# Altium schematic sheet device.SchDoc
size A4
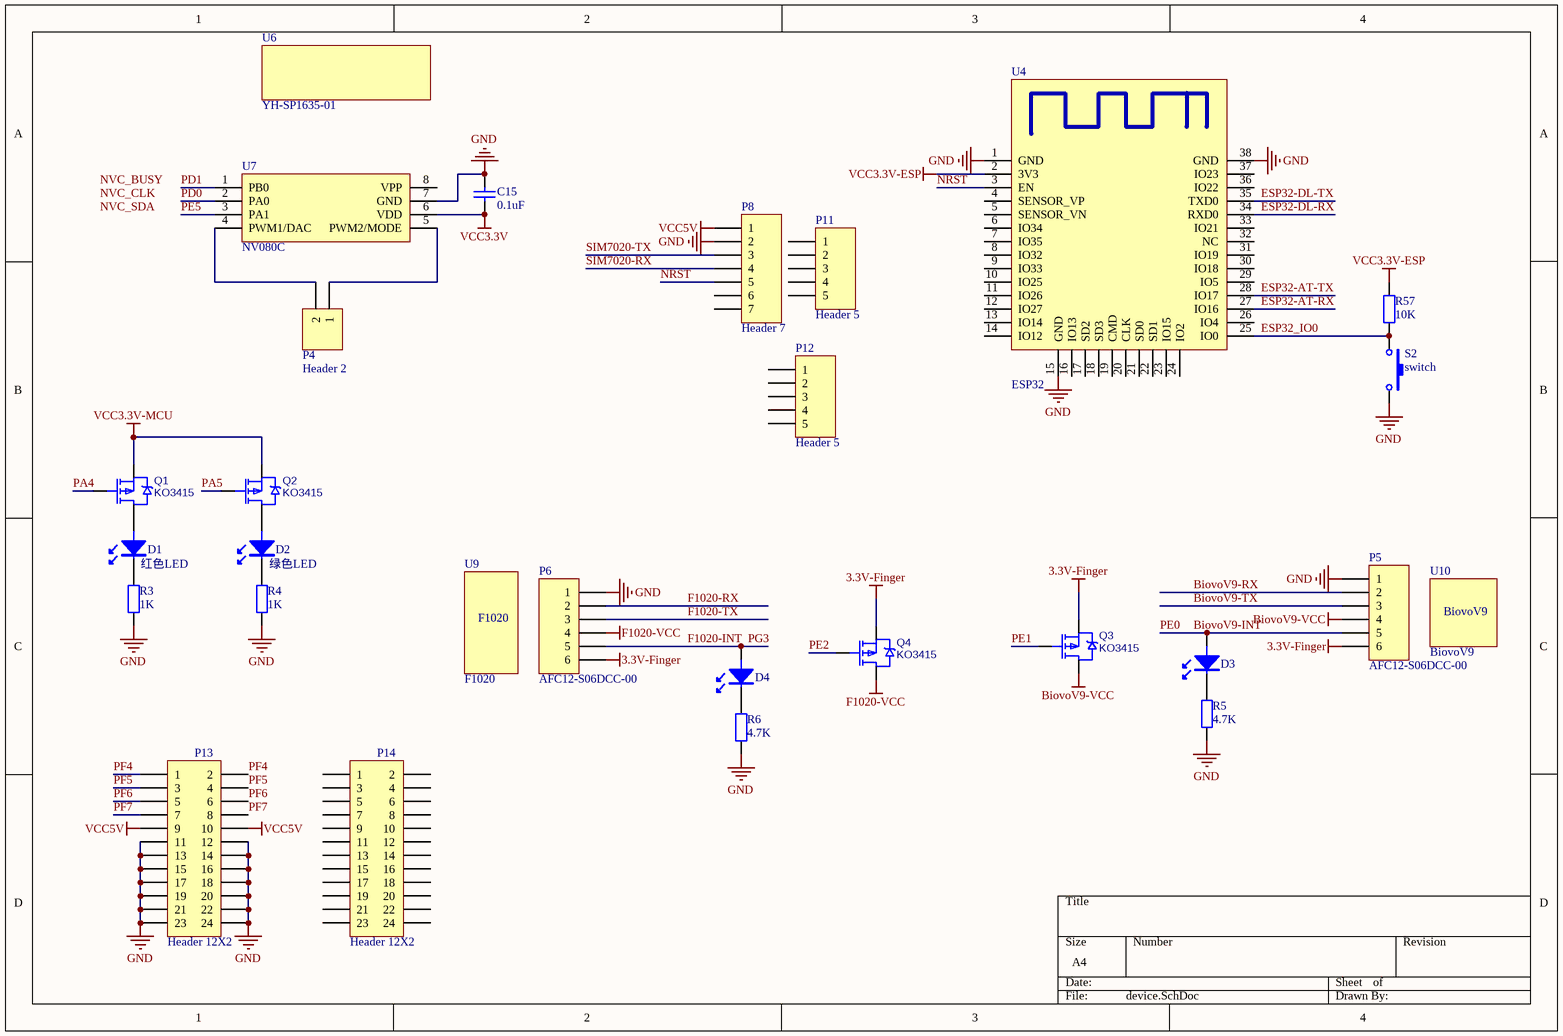
[diagram p0: device.SchDoc]

## Parts
C15  0.1uF  [0603_C]
D1  红色LED  [LED_1206]
D2  绿色LED  [LED_1206]
D3  LED  [0603_LED_S1]  (value not drawn)
D4  LED  [0603_LED_S1]  (value not drawn)
P4  Header 2  [HDR1X2]
P5  AFC12-S06DCC-00  [CONN-SMD_6PIN_AFC12-S06DCC-00_PITCH1.25-L]
P6  AFC12-S06DCC-00  [CONN-SMD_6PIN_AFC12-S06DCC-00_PITCH1.25-L]
P8  Header 7  [HDR1X7]
P11  Header 5  [HDR1X5]
P12  Header 5  [HDR1X5]
P13  Header 12X2  [2.0mm 2*12P直排母]
P14  Header 12X2  [2.0mm 2*12P直排母]
Q1  KO3415  [SOT-23(SOT-23-3)]
Q2  KO3415  [SOT-23(SOT-23-3)]
Q3  KO3415  [SOT-23(SOT-23-3)]
Q4  KO3415  [SOT-23(SOT-23-3)]
R3  1K  [0603_R]
R4  1K  [0603_R]
R5  4.7K  [0603_R]
R6  4.7K  [0603_R]
R57  10K  [0603_R]
S2  switch  [SW-SMD_4P-L6.2-W6.2-P4.50-LS9.0]
U4  ESP32  [WIFIM-SMD_ESP32-S32MB]
U6  YH-SP1635-01  [YH-SP1635-01]
U7  NV080C  [SOP-8_150mil]
U9  F1020  [F1020]
U10  BiovoV9  [BiovoV9]

## Nets
3.3V-Finger: P5.6 P6.6 Q3.2(S) Q4.2(S)
BiovoV9-VCC: P5.4 Q3.3(D)
F1020-VCC: P6.4 Q4.3(D)
GND: C15.2 P5.1 P6.1 P8.2 P13.11 P13.12 P13.13 P13.14 P13.15 P13.16 P13.17 P13.18 P13.19 P13.20 P13.21 P13.22 P13.23 P13.24 R3.1 R4.1 R5.1 R6.1 S2.2 U4.1(GND) U4.15(GND) U4.38(GND) U7.7(GND)
VCC3.3V: C15.1 U7.6(VDD)
VCC3.3V-ESP: R57.2 U4.2(3V3)
VCC3.3V-MCU: Q1.2(S) Q2.2(S)
VCC5V: P8.1 P13.9 P13.10
BiovoV9-INT: D3.A P5.5  [also labelled PE0]
BiovoV9-RX: P5.2
BiovoV9-TX: P5.3
ESP32-AT-RX: U4.27(IO16)
ESP32-AT-TX: U4.28(IO17)
ESP32-DL-RX: U4.34(RXD0)
ESP32-DL-TX: U4.35(TXD0)
ESP32_IO0: R57.1 S2.1 U4.25(IO0)
F1020-INT: D4.A P6.5  [also labelled PG3]
F1020-RX: P6.2
F1020-TX: P6.3
NRST: P8.5 U4.3(EN)
PA4: Q1.1(G)
PA5: Q2.1(G)
PD0: U7.2(PA0)
PD1: U7.1(PB0)
PE1: Q3.1(G)
PE2: Q4.1(G)
PE5: U7.3(PA1)
PF4: P13.1 P13.2
PF5: P13.3 P13.4
PF6: P13.5 P13.6
PF7: P13.7 P13.8
SIM7020-RX: P8.4
SIM7020-TX: P8.3
NetD1_A: D1.A Q1.3(D)
NetD1_K: D1.K R3.2
NetD2_A: D2.A Q2.3(D)
NetD2_K: D2.K R4.2
NetD3_K: D3.K R5.2
NetD4_K: D4.K R6.2
NetP4_1: P4.1 U7.5(PWM2/MODE)
NetP4_2: P4.2 U7.4(PWM1/DAC)

Not connected (* = marked no-connect by the designer): P8 6 7; P11 1 2 3 4 5; P12 1 2 3 4 5; P14 1 2 3 4 5 6 7 8 9 10 11 12 13 14 15 16 17 18 19 20 21 22 23 24; U4 4(SENSOR_VP) 5(SENSOR_VN) 6(IO34) 7(IO35) 8(IO32) 9(IO33) 10(IO25) 11(IO26) 12(IO27) 13(IO14) 14(IO12) 16(IO13) 17(SD2) 18(SD3) 19(CMD) 20(CLK) 21(SD0) 22(SD1) 23(IO15) 24(IO2) 26(IO4) 29(IO5) 30(IO18) 31(IO19) 32(NC) 33(IO21) 36(IO22) 37(IO23); U7 8(VPP)

## Notes on the sheet
- Labels drawn without touching a wire or pin: NVC_BUSY, NVC_CLK, NVC_SDA

## Library data of the parts
C15 = Cap: 贴片电容，0603
D1 = LED: 1206封装，红色LED
D2 = LED: 1206封装，绿色LED
D3 D4 = LED: 贴片LED，0603，白色
P4 = Header 2: 不焊; LatestRevisionDate: 17-Jul-2002; LatestRevisionNote: Re-released for DXP Platform.; Publisher: Altium Limited
P5 P6 = Header 6: 1.25MM 6P 卧式贴片插座连接器
P8 = Header 7: Header, 7-Pin; LatestRevisionDate: 17-Jul-2002; LatestRevisionNote: Re-released for DXP Platform.; Publisher: Altium Limited
P11 P12 = Header 5: Header, 5-Pin; LatestRevisionDate: 17-Jul-2002; LatestRevisionNote: Re-released for DXP Platform.; Publisher: Altium Limited
P13 P14 = Header 12X2: Header, 12-Pin, Dual row; LatestRevisionDate: 17-Jul-2002; LatestRevisionNote: Re-released for DXP Platform.; Publisher: Altium Limited
Q1-Q4 = 3415: KO3415,SOT23-3
R3-R6 R57 = Res2: 贴片电阻，0603
S2 = switch: 贴片按键，6*6*5
U6 = speaker: 1635腔体喇叭，不焊
U7 = NVCXXXC: 语音芯片，SOP-8
U9 = F1020: 不焊
U10 = BiovoV9: 不焊